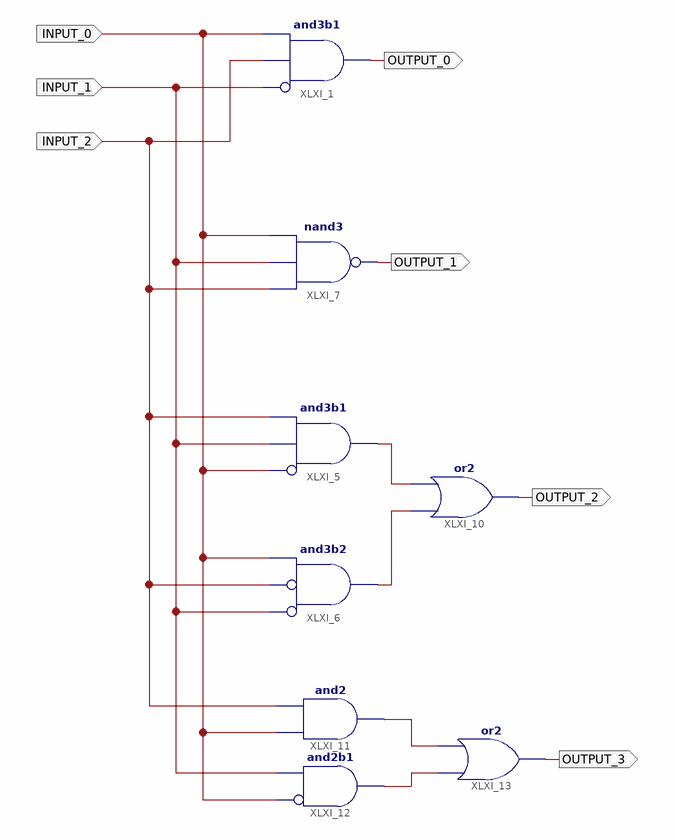
[diagram p0: schematic sheet 1]
// Xilinx ISE schematic Eugen_LAB_1.sch (spartan3a) as structural Verilog: 8 symbols, 7 ports
module Eugen_LAB_1 (
  input  INPUT_0,
  input  INPUT_2,
  input  INPUT_1,
  output OUTPUT_0,
  output OUTPUT_1,
  output OUTPUT_2,
  output OUTPUT_3
);

  wire XLXN_7, XLXN_8, XLXN_9, XLXN_10;

  and XLXI_1 (OUTPUT_0, ~INPUT_1, INPUT_2, INPUT_0);  // and3b1
  nand XLXI_7 (OUTPUT_1, INPUT_2, INPUT_1, INPUT_0);
  and XLXI_5 (XLXN_7, ~INPUT_0, INPUT_1, INPUT_2);  // and3b1
  and XLXI_6 (XLXN_8, ~INPUT_1, ~INPUT_2, INPUT_0);  // and3b2
  or XLXI_10 (OUTPUT_2, XLXN_8, XLXN_7);
  and XLXI_11 (XLXN_9, INPUT_0, INPUT_2);
  and XLXI_12 (XLXN_10, ~INPUT_0, INPUT_1);  // and2b1
  or XLXI_13 (OUTPUT_3, XLXN_10, XLXN_9);
endmodule
